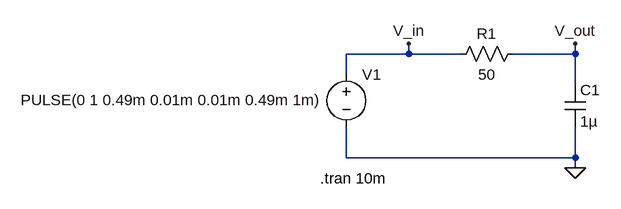
[diagram p0: schematic RC_Circuit.asc]
RC_Circuit.asc, the LTspice schematic file:
Version 4
SHEET 1 880 680
WIRE 48 80 48 64
WIRE 48 80 -48 80
WIRE 128 80 48 80
WIRE 304 80 304 64
WIRE 304 80 208 80
WIRE -48 112 -48 80
WIRE 304 128 304 80
WIRE -48 240 -48 192
WIRE 304 240 304 192
WIRE 304 240 -48 240
WIRE 304 256 304 240
FLAG 304 256 0
FLAG 48 64 V_in
FLAG 304 64 V_out
SYMBOL voltage -48 96 R0
WINDOW 3 -501 55 Left 2
WINDOW 123 0 0 Left 2
WINDOW 39 0 0 Left 2
SYMATTR Value PULSE(0 1 0.49m 0.01m 0.01m 0.49m 1m)
SYMATTR InstName V1
SYMBOL cap 288 128 R0
SYMATTR InstName C1
SYMATTR Value 1µ
SYMBOL res 112 96 R270
WINDOW 0 32 56 VTop 2
WINDOW 3 0 56 VBottom 2
SYMATTR InstName R1
SYMATTR Value 50
TEXT -88 272 Left 2 !.tran 10m

The netlist it stands for:
* RC_Circuit.asc
V1 V_in 0 PULSE(0 1 0.49m 0.01m 0.01m 0.49m 1m)
C1 V_out 0 1µ
R1 V_in V_out 50
.tran 10m
.backanno
.end